# EAGLE schematic Razz_control_board (EAGLE 7.7.0)
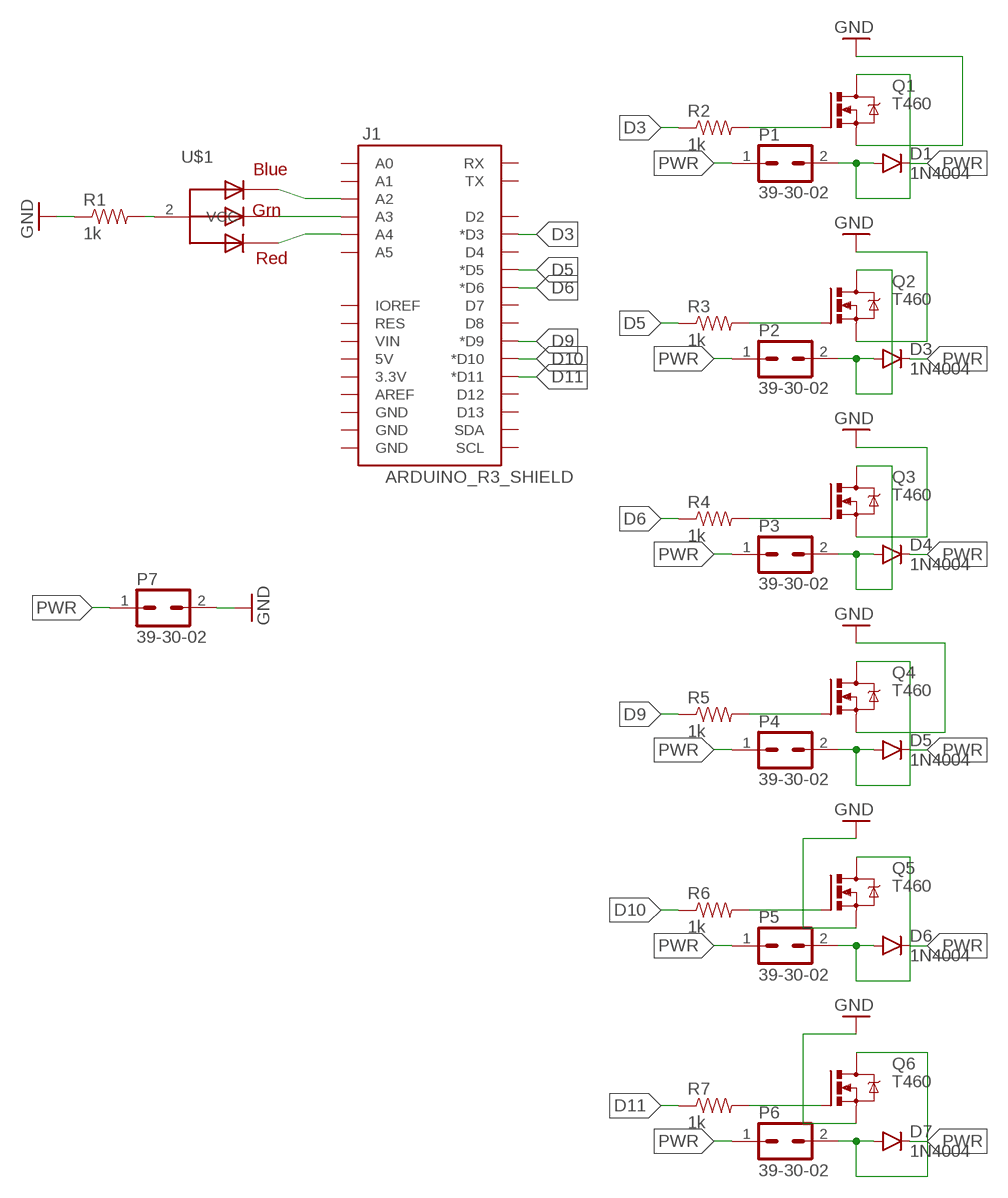
[diagram p0: schematic, sheet 1]

## Parts
D1  1N4004  DIODEPTH  [DIODE-1N4001]
D3  1N4004  DIODEPTH  [DIODE-1N4001]
D4  1N4004  DIODEPTH  [DIODE-1N4001]
D5  1N4004  DIODEPTH  [DIODE-1N4001]
D6  1N4004  DIODEPTH  [DIODE-1N4001]
D7  1N4004  DIODEPTH  [DIODE-1N4001]
J1  ARDUINO_R3_SHIELD  [UNO_R3_SHIELD]
P1  39-30-02  [39-30-?02?]
P2  39-30-02  [39-30-?02?]
P3  39-30-02  [39-30-?02?]
P4  39-30-02  [39-30-?02?]
P5  39-30-02  [39-30-?02?]
P6  39-30-02  [39-30-?02?]
P7  39-30-02  [39-30-?02?]
Q1  T460  IRF540  [TO220BV]
Q2  T460  IRF540  [TO220BV]
Q3  T460  IRF540  [TO220BV]
Q4  T460  IRF540  [TO220BV]
Q5  T460  IRF540  [TO220BV]
Q6  T460  IRF540  [TO220BV]
R1  1k  RESISTOREZ  [AXIAL-0.3EZ]
R2  1k  RESISTOREZ  [AXIAL-0.3EZ]
R3  1k  RESISTOREZ  [AXIAL-0.3EZ]
R4  1k  RESISTOREZ  [AXIAL-0.3EZ]
R5  1k  RESISTOREZ  [AXIAL-0.3EZ]
R6  1k  RESISTOREZ  [AXIAL-0.3EZ]
R7  1k  RESISTOREZ  [AXIAL-0.3EZ]
U$1  RGBLED_CA  [LED5MMRGB]

## Nets
D3: J1.D3(*D3) R2.P$1
D5: J1.D5(*D5) R3.P$1
D6: J1.D6(*D6) R4.P$1
D9: J1.D9(*D9) R5.P$1
D10: J1.D10(*D10) R6.P$1
D11: J1.D11(*D11) R7.P$1
GND: P7.2 Q1.S Q2.S Q3.S Q4.S Q5.S Q6.S R1.P$1
N$2: J1.A2 U$1.4(BLUE)
N$3: D1.A P1.2 Q1.D
N$4: J1.A4 U$1.1(RED)
N$5: J1.A3 U$1.3(GREEN)
N$8: R1.P$2 U$1.2(VCC)
N$9: Q2.G R3.P$2
N$10: D3.A P2.2 Q2.D
N$11: Q1.G R2.P$2
N$12: Q3.G R4.P$2
N$13: D4.A P3.2 Q3.D
N$15: Q4.G R5.P$2
N$16: D5.A P4.2 Q4.D
N$18: Q5.G R6.P$2
N$19: D6.A P5.2 Q5.D
N$21: Q6.G R7.P$2
N$22: D7.A P6.2 Q6.D
PWR: D1.C D3.C D4.C D5.C D6.C D7.C P1.1 P2.1 P3.1 P4.1 P5.1 P6.1 P7.1
Unconnected: J1.3.3V J1.5V J1.A0 J1.A1 J1.A5 J1.AREF J1.D2 J1.D4 J1.D7 J1.D8 J1.D12 J1.D13 J1.GND@0(GND) J1.GND@1(GND) J1.GND@2(GND) J1.IOREF J1.RES J1.RX J1.SCL J1.SDA J1.TX J1.VIN

## Library data of the parts
D1 D3-D7 = SparkFun-DiscreteSemi:DIODE: Diode These are standard reverse protection diodes and small signal diodes. SMA package can handle up to about 1A. SOD-323 can handle about 200mA. What the SOD-323 package when ordering, there are some mfgs out there that are 5-pin packages.
J1 = Nathans-Arduinos2:ARDUINO_R3_SHIELD: Shield form compatible with the Arduino Uno R3.
P1-P7 = con-molex-mini-fit:39-30-?02?: HEADER
Q1-Q6 = transistor-power:IRF540: HEXFET Power MOSFET
R1-R7 = SparkFun-Passives:RESISTOR: Resistor Basic schematic elements and footprints for 0603, 1206, and PTH resistors.
U$1 = adafruit:RGBLED_CA: RGB LED, common-anode Staggered pins http://www.ladyada.net/library/pcb/eaglelibrary.html

## Net classes
0 default: width 0.61 mm, drill 0.406 mm, clearance 0.406 mm